# EAGLE design LeCoolStick-v1_1 (EAGLE 7.3.0)
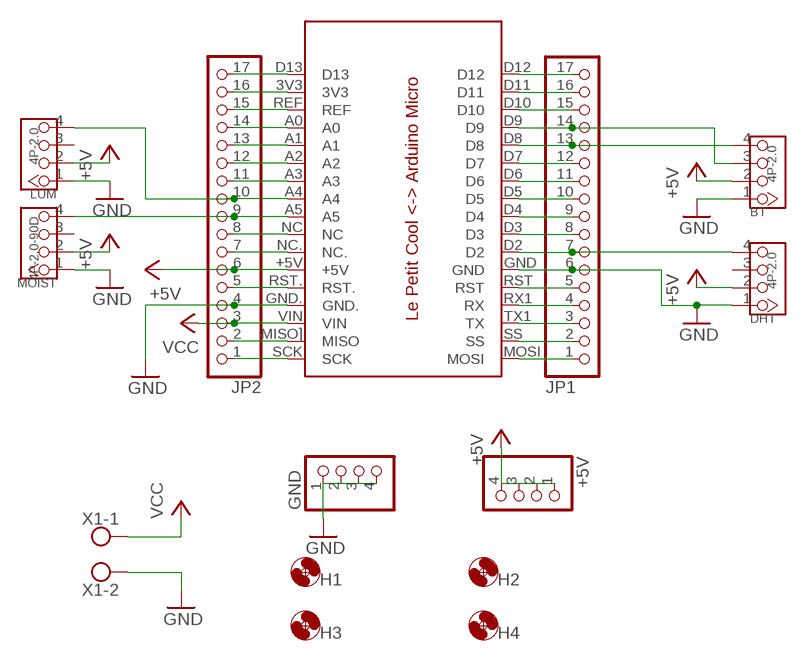
[diagram p0: schematic, sheet 1]

## Parts
+5V  PINHD-1X4  [1X04]
BT  4P-2.0  TWIG-4P-2.0-2.0  [4P-2.0]
DHT  4P-2.0  TWIG-4P-2.0-2.0  [4P-2.0]
GND  PINHD-1X4  [1X04]
H1  MOUNT-HOLEHOLE-2.8  [HOLE-2,8]
H2  MOUNT-HOLEHOLE-2.8  [HOLE-2,8]
H3  MOUNT-HOLEHOLE-2.8  [HOLE-2,8]
H4  MOUNT-HOLEHOLE-2.8  [HOLE-2,8]
JP1  PINHD-1X17  [1X17]
JP2  PINHD-1X17  [1X17]
LUM  4P-2.0  TWIG-4P-2.0-2.0  [4P-2.0]
MOIST  4P-2.0-90D  TWIG-4P-2.0'90D'  [4P-2.0-90D]
PCB1  SHIELD_MICRO  [SHIELD_MICRO]
X1  AK500/2  [AK500/2]

## Nets
3.3V: JP2.16 PCB1.3V3
+5V: +5V.1 +5V.2 +5V.3 +5V.4 BT.2 DHT.2 JP2.6 LUM.2 MOIST.2 PCB1.+5V
A0-FREE: JP2.14 PCB1.A0
A1-FREE: JP2.13 PCB1.A1
A2-FREE: JP2.12 PCB1.A2
A3-FREE: JP2.11 PCB1.A3
A4-LUM: JP2.10 LUM.4 PCB1.A4
A5-MOIST: JP2.9 MOIST.4 PCB1.A5
AREF: JP2.15 PCB1.REF
D0-RX1: JP1.4 PCB1.RX1(RX)
D0-TX1: JP1.3 PCB1.TX1(TX)
D2-DHT: DHT.4 JP1.7 PCB1.D2
D3-FREE: JP1.8 PCB1.D3
D4-FREE: JP1.9 PCB1.D4
D5-FREE: JP1.10 PCB1.D5
D6-FREE: JP1.11 PCB1.D6
D7-FREE: JP1.12 PCB1.D7
D8-BT(TX): BT.4 JP1.13 PCB1.D8
D9-BT(RX): BT.3 JP1.14 PCB1.D9
D10-FREE: JP1.15 PCB1.D10
D11-FREE: JP1.16 PCB1.D11
D12-FREE: JP1.17 PCB1.D12
D13-FREE: JP2.17 PCB1.D13
GND: BT.1 DHT.1 GND.1 GND.2 GND.3 GND.4 JP1.6 JP2.4 LUM.1 MOIST.1 PCB1.GND PCB1.GND. X1.2
MISO-FREE: JP2.2 PCB1.MISO](MISO)
MOSI-FREE: JP1.1 PCB1.MOSI
N/C: JP2.8 PCB1.NC
N/C.: JP2.7 PCB1.NC.
RST: JP1.5 PCB1.RST
RST.: JP2.5 PCB1.RST.
SCK-FREE: JP2.1 PCB1.SCK
SS-FREE: JP1.2 PCB1.SS
VCC: JP2.3 PCB1.VIN X1.1
Unconnected: DHT.3 LUM.3 MOIST.3

## Library data of the parts
+5V GND = LaCoolCo_Library:PINHD-1X4: PIN HEADER
BT DHT LUM MOIST = LaCoolCo_Library:TWIG-4P-2.0
H1-H4 = LaCoolCo_Library:MOUNT-HOLE: MOUNTING HOLE with drill center marker
JP1 JP2 = LaCoolCo_Library:PINHD-1X17: PIN HEADER
PCB1 = LaCoolCo_Library:SHIELD_MICRO
X1 = LaCoolCo_Library:AK500/2: CONNECTOR; OC_FARNELL: unknown; OC_NEWARK: unknown

## Net classes
0 default: width 1.27 mm, clearance 0.305 mm

## Board
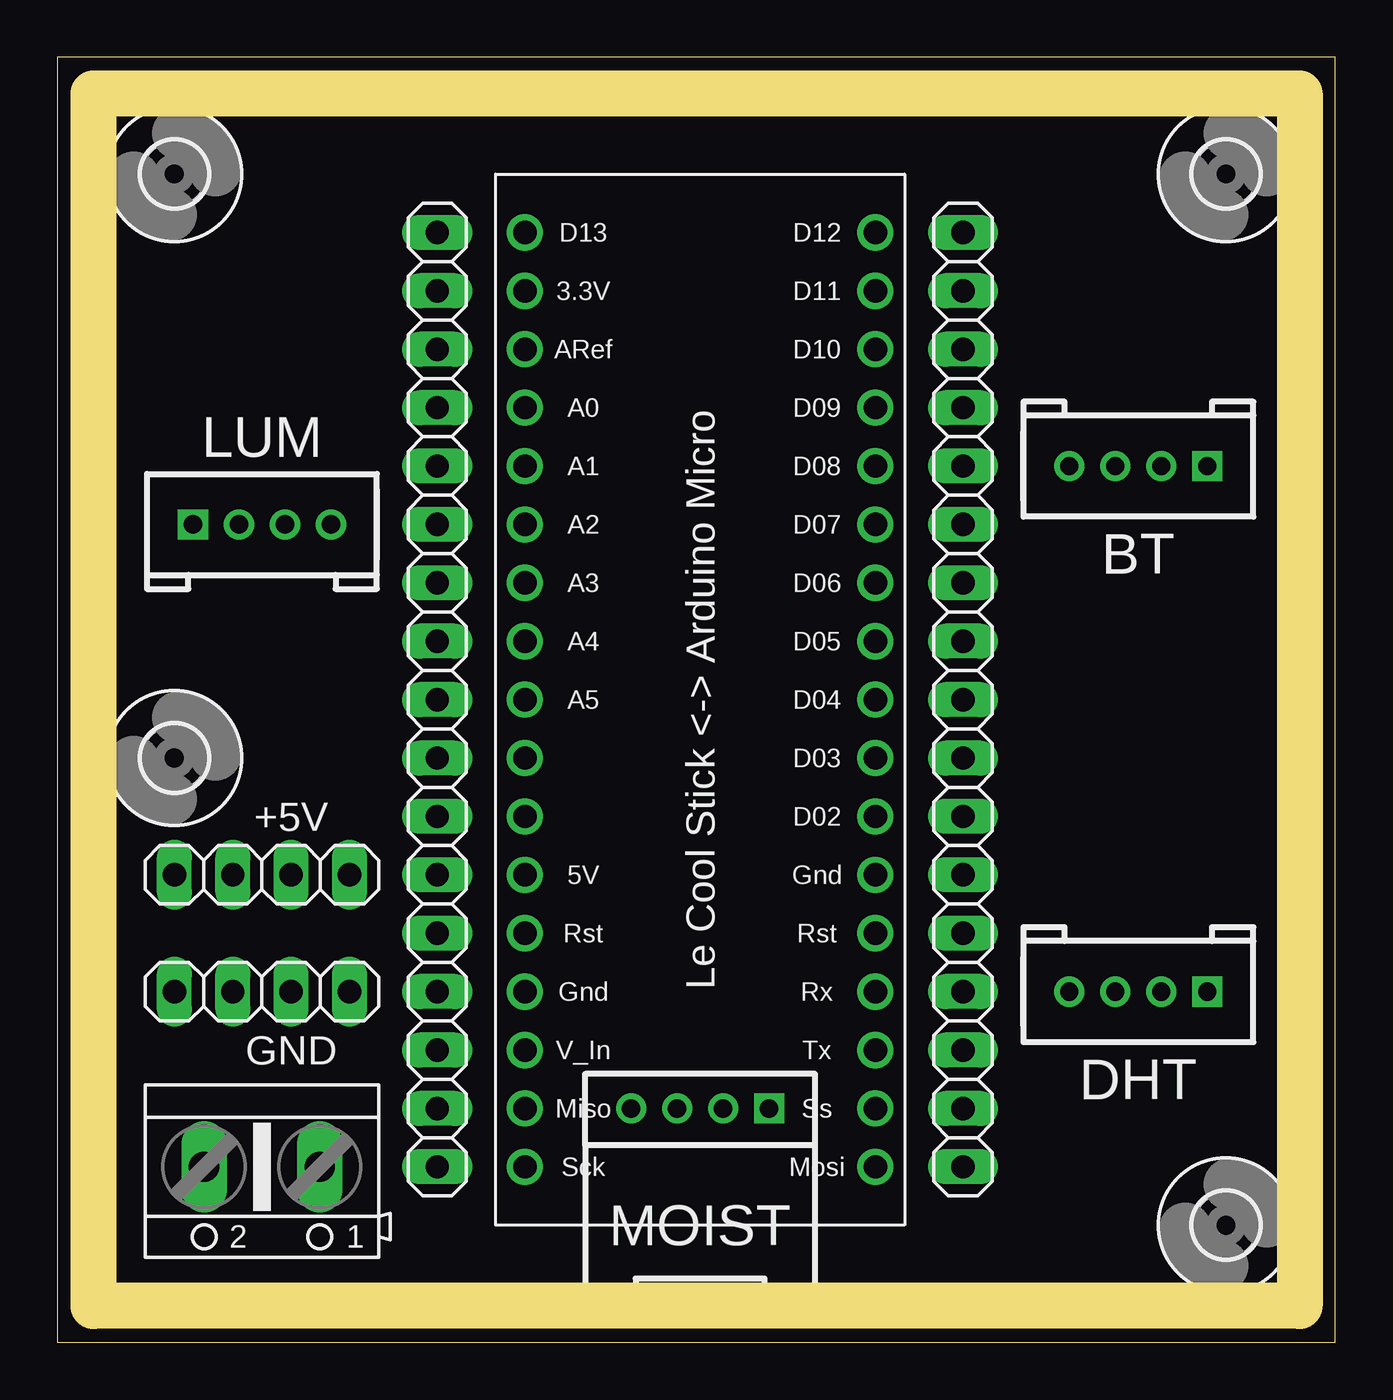
[diagram p1: board, top side]
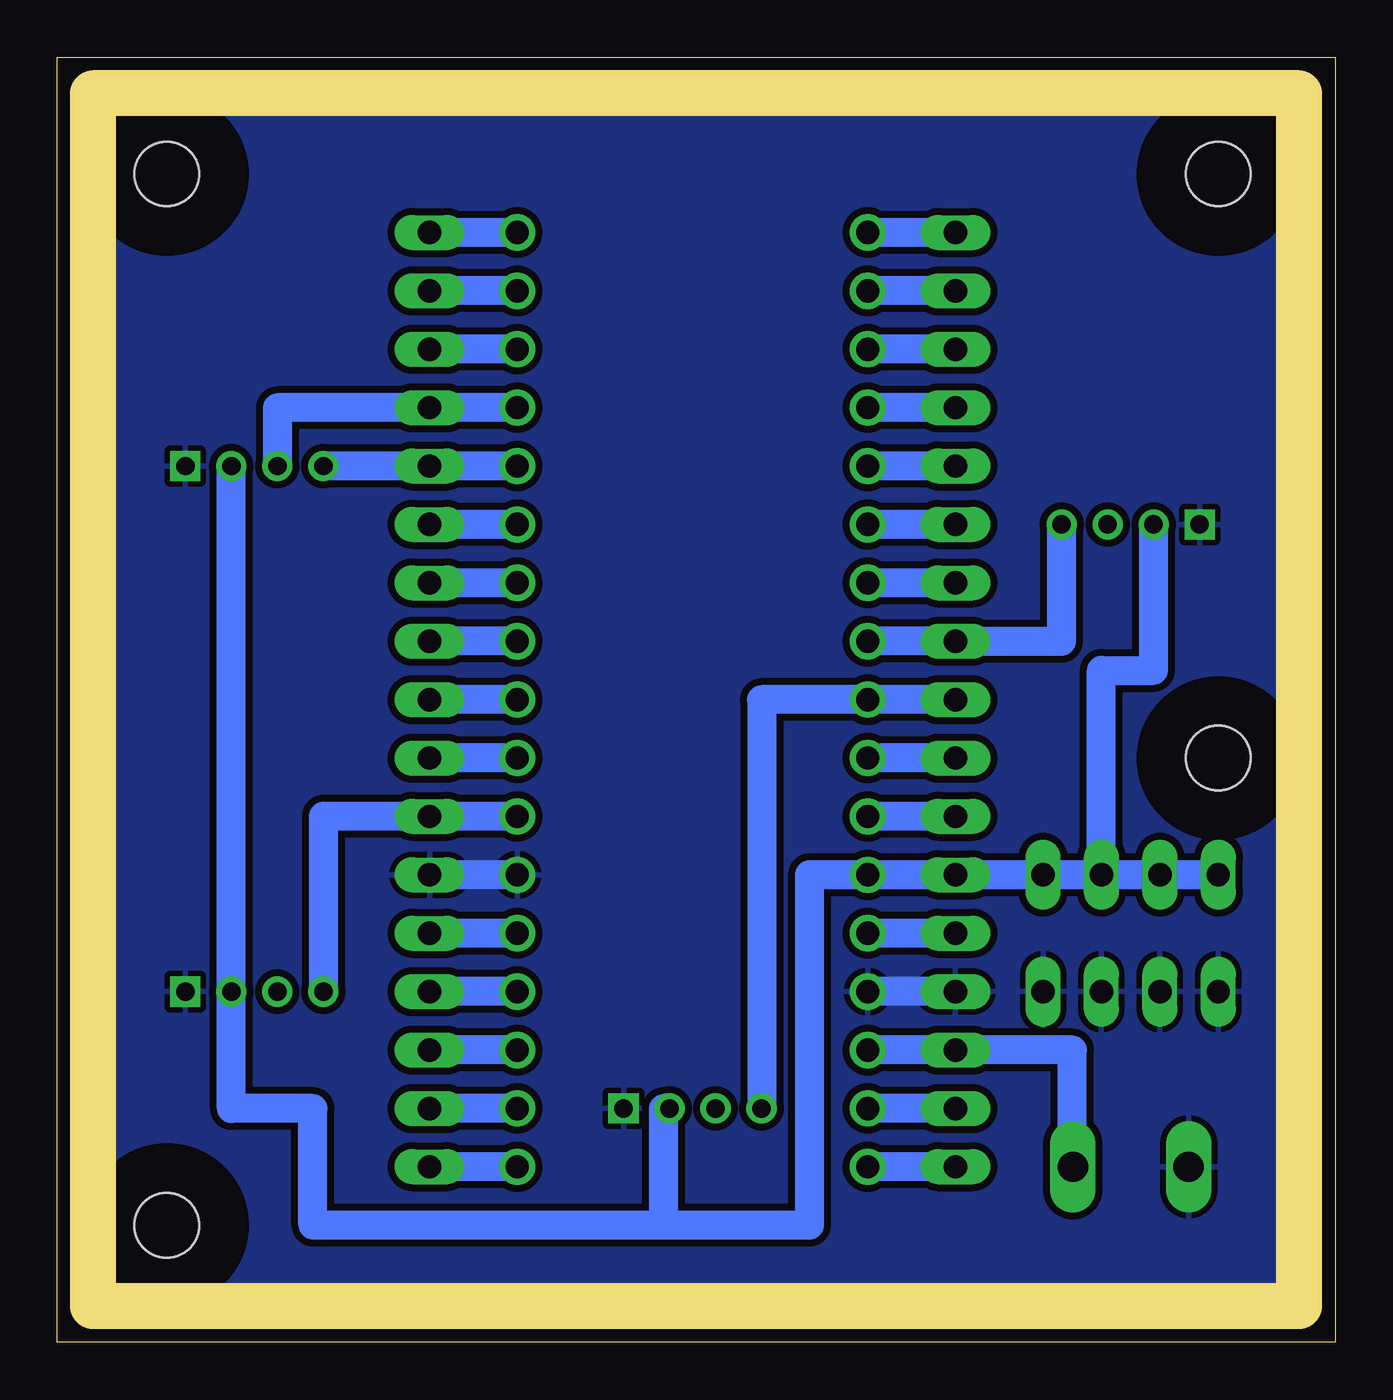
[diagram p2: board, bottom side, seen from below]

Size 55.55 x 55.87 mm. Coordinates in mm from the lower left corner, seen from the top.
Outline: 0,0 55.55,0 55.55,55.87 0,55.87 0,0
Copper layers (1*16): Top 0.035mm / dielectric 1.5mm / Bottom 0.035mm
Design rules "default": minimum track width 10mil, minimum drill 24mil, track to track 8mil, track to pad 8mil, pad to pad 8mil, via to via 8mil, smd to smd 8mil, copper to edge 40mil, drill to drill 8mil, minimum pad ring 10mil, minimum via ring 8mil, stop-mask expansion 4mil, vias tented up to drill 0mil, thermal gap 10mil
Milling: 4 lines

### Footprints (pad centres in the part's own frame; a part is rotated, then mirrored left to right if it is on the bottom)
1X04 = drill 1.016 long: 1 -3.81,0; 2 -1.27,0; 3 1.27,0; 4 3.81,0
4P-2.0 = drill 0.8 pad 1.27 square: 1 -3,0 | drill 0.8 pad 1.27: 2 -1,0; 3 1,0; 4 3,0
HOLE-2,8 = hole 2.8: 0,0
1X17 = drill 1.016 long: 1 -20.32,0; 2 -17.78,0; 3 -15.24,0; 4 -12.7,0; 5 -10.16,0; 6 -7.62,0; 7 -5.08,0; 8 -2.54,0; 9 0,0; 10 2.54,0; 11 5.08,0; 12 7.62,0; 13 10.16,0; 14 12.7,0; 15 15.24,0; 16 17.78,0; 17 20.32,0
4P-2.0-90D = drill 0.8 pad 1.27 square: 1 -3,0 | drill 0.8 pad 1.27: 2 -1,0; 3 1,0; 4 3,0
SHIELD_MICRO = drill 1.016 pad 1.575: 3V3 -17.78,-7.62; +5V 7.62,-7.62; A0 -12.7,-7.62; A1 -10.16,-7.62; A2 -7.62,-7.62; A3 -5.08,-7.62; A4 -2.54,-7.62; A5 0,-7.62; D2 5.08,7.62; D3 2.54,7.62; D4 0,7.62; D5 -2.54,7.62; D6 -5.08,7.62; D7 -7.62,7.62; D8 -10.16,7.62; D9 -12.7,7.62; D10 -15.24,7.62; D11 -17.78,7.62; D12 -20.32,7.62; D13 -20.32,-7.62; GND 7.62,7.62; GND. 12.7,-7.62; MISO] 17.78,-7.62; MOSI 20.32,7.62; NC 2.54,-7.62; NC. 5.08,-7.62; REF -15.24,-7.62; RST 10.16,7.62; RST. 10.16,-7.62; RX1 12.7,7.62; SCK 20.32,-7.62; SS 17.78,7.62; TX1 15.24,7.62; VIN 15.24,-7.62
AK500/2 = drill 1.321 long: 1 -2.515,0; 2 2.515,0

### Placement (x,y rotation side)
+5V  8.89,20.32 0 top
BT  46.99,38.1 180 top
DHT  46.99,15.24 180 top
GND  8.89,15.24 0 top
H1  5.08,50.8 0 top
H2  5.08,25.4 0 top
H3  50.8,50.8 0 top
H4  50.8,5.08 0 top
JP1  39.37,27.94 90 top
JP2  16.51,27.94 90 top
LUM  8.89,35.56 0 top
MOIST  27.94,10.16 180 top
PCB1  27.94,27.94 270 top
X1  8.89,7.62 180 top

### Tracks (layer width: path | path; a pad name or v marks a point on that pad's centre or on a via)
3.3V
  Bottom 1.27: JP2.16 PCB1.3V3
+5V
  Bottom 1.27: +5V.1 +5V.2 +5V.3 | +5V.3 +5V.4 JP2.6 PCB1.+5V 22.86,20.32 22.86,5.08 29.21,5.08 | 29.21,5.08 44.45,5.08 44.45,10.16 47.99,10.16 BT.2 DHT.2 | MOIST.2 29.21,10.16 29.21,5.08 | +5V.3 10.16,29.21 7.89,29.21 LUM.2
A0-FREE
  Bottom 1.27: JP2.14 PCB1.A0
A1-FREE
  Bottom 1.27: JP2.13 PCB1.A1
A2-FREE
  Bottom 1.27: JP2.12 PCB1.A2
A3-FREE
  Bottom 1.27: JP2.11 PCB1.A3
A4-LUM
  Bottom 1.27: PCB1.A4 JP2.10 11.89,30.48 LUM.4
A5-MOIST
  Bottom 1.27: JP2.9 PCB1.A5 24.94,27.94 MOIST.4
AREF
  Bottom 1.27: JP2.15 PCB1.REF
D0-RX1
  Bottom 1.27: PCB1.RX1 JP1.4
D0-TX1
  Bottom 1.27: PCB1.TX1 JP1.3
D2-DHT
  Bottom 1.27: PCB1.D2 JP1.7 43.99,22.86 DHT.4
D3-FREE
  Bottom 1.27: PCB1.D3 JP1.8
D4-FREE
  Bottom 1.27: PCB1.D4 JP1.9
D5-FREE
  Bottom 1.27: PCB1.D5 JP1.10
D6-FREE
  Bottom 1.27: PCB1.D6 JP1.11
D7-FREE
  Bottom 1.27: PCB1.D7 JP1.12
D8-BT(TX)
  Bottom 1.27: PCB1.D8 JP1.13 BT.4
D9-BT(RX)
  Bottom 1.27: PCB1.D9 JP1.14 45.99,40.64 BT.3
D10-FREE
  Bottom 1.27: PCB1.D10 JP1.15
D11-FREE
  Bottom 1.27: PCB1.D11 JP1.16
D12-FREE
  Bottom 1.27: PCB1.D12 JP1.17
D13-FREE
  Bottom 1.27: JP2.17 PCB1.D13
GND
  Bottom 1.27: JP2.4 PCB1.GND. | PCB1.GND JP1.6
  pour Bottom: 2.54,53.34 53.34,53.34 53.34,2.54 2.54,2.54
MISO-FREE
  Bottom 1.27: JP2.2 PCB1.MISO]
MOSI-FREE
  Bottom 1.27: PCB1.MOSI JP1.1
N/C
  Bottom 1.27: JP2.8 PCB1.NC
N/C.
  Bottom 1.27: JP2.7 PCB1.NC.
RST
  Bottom 1.27: PCB1.RST JP1.5
RST.
  Bottom 1.27: JP2.5 PCB1.RST.
SCK-FREE
  Bottom 1.27: JP2.1 PCB1.SCK
SS-FREE
  Bottom 1.27: PCB1.SS JP1.2
VCC
  Bottom 1.27: PCB1.VIN JP2.3 11.43,12.7 11.43,7.62 X1.1